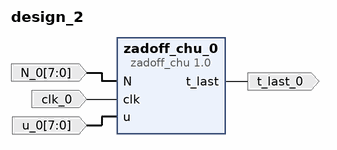
[diagram p0: block diagram of the top level]
# Vivado block design design_2, xczu7ev-ffvc1156-2-e, Vivado 2022.2
create_bd_design design_2

create_bd_port -dir I -type clk clk_0
create_bd_port -dir I -from 7 -to 0 u_0
create_bd_port -dir I -from 7 -to 0 N_0
create_bd_port -dir O t_last_0

create_bd_cell -type ip -vlnv xilinx.com:user:zadoff_chu:1.0 zadoff_chu_0

# ---- connections ----

connect_bd_net -net N_0_1 [get_bd_ports N_0] [get_bd_pins zadoff_chu_0/N]
connect_bd_net -net clk_0_1 [get_bd_ports clk_0] [get_bd_pins zadoff_chu_0/clk]
connect_bd_net -net u_0_1 [get_bd_ports u_0] [get_bd_pins zadoff_chu_0/u]
connect_bd_net [get_bd_pins zadoff_chu_0/t_last] [get_bd_ports t_last_0]

validate_bd_design
save_bd_design
